# Altium schematic sheet Lan.SchDoc
size A3; SheetNumber: 8; SheetTotal: 8
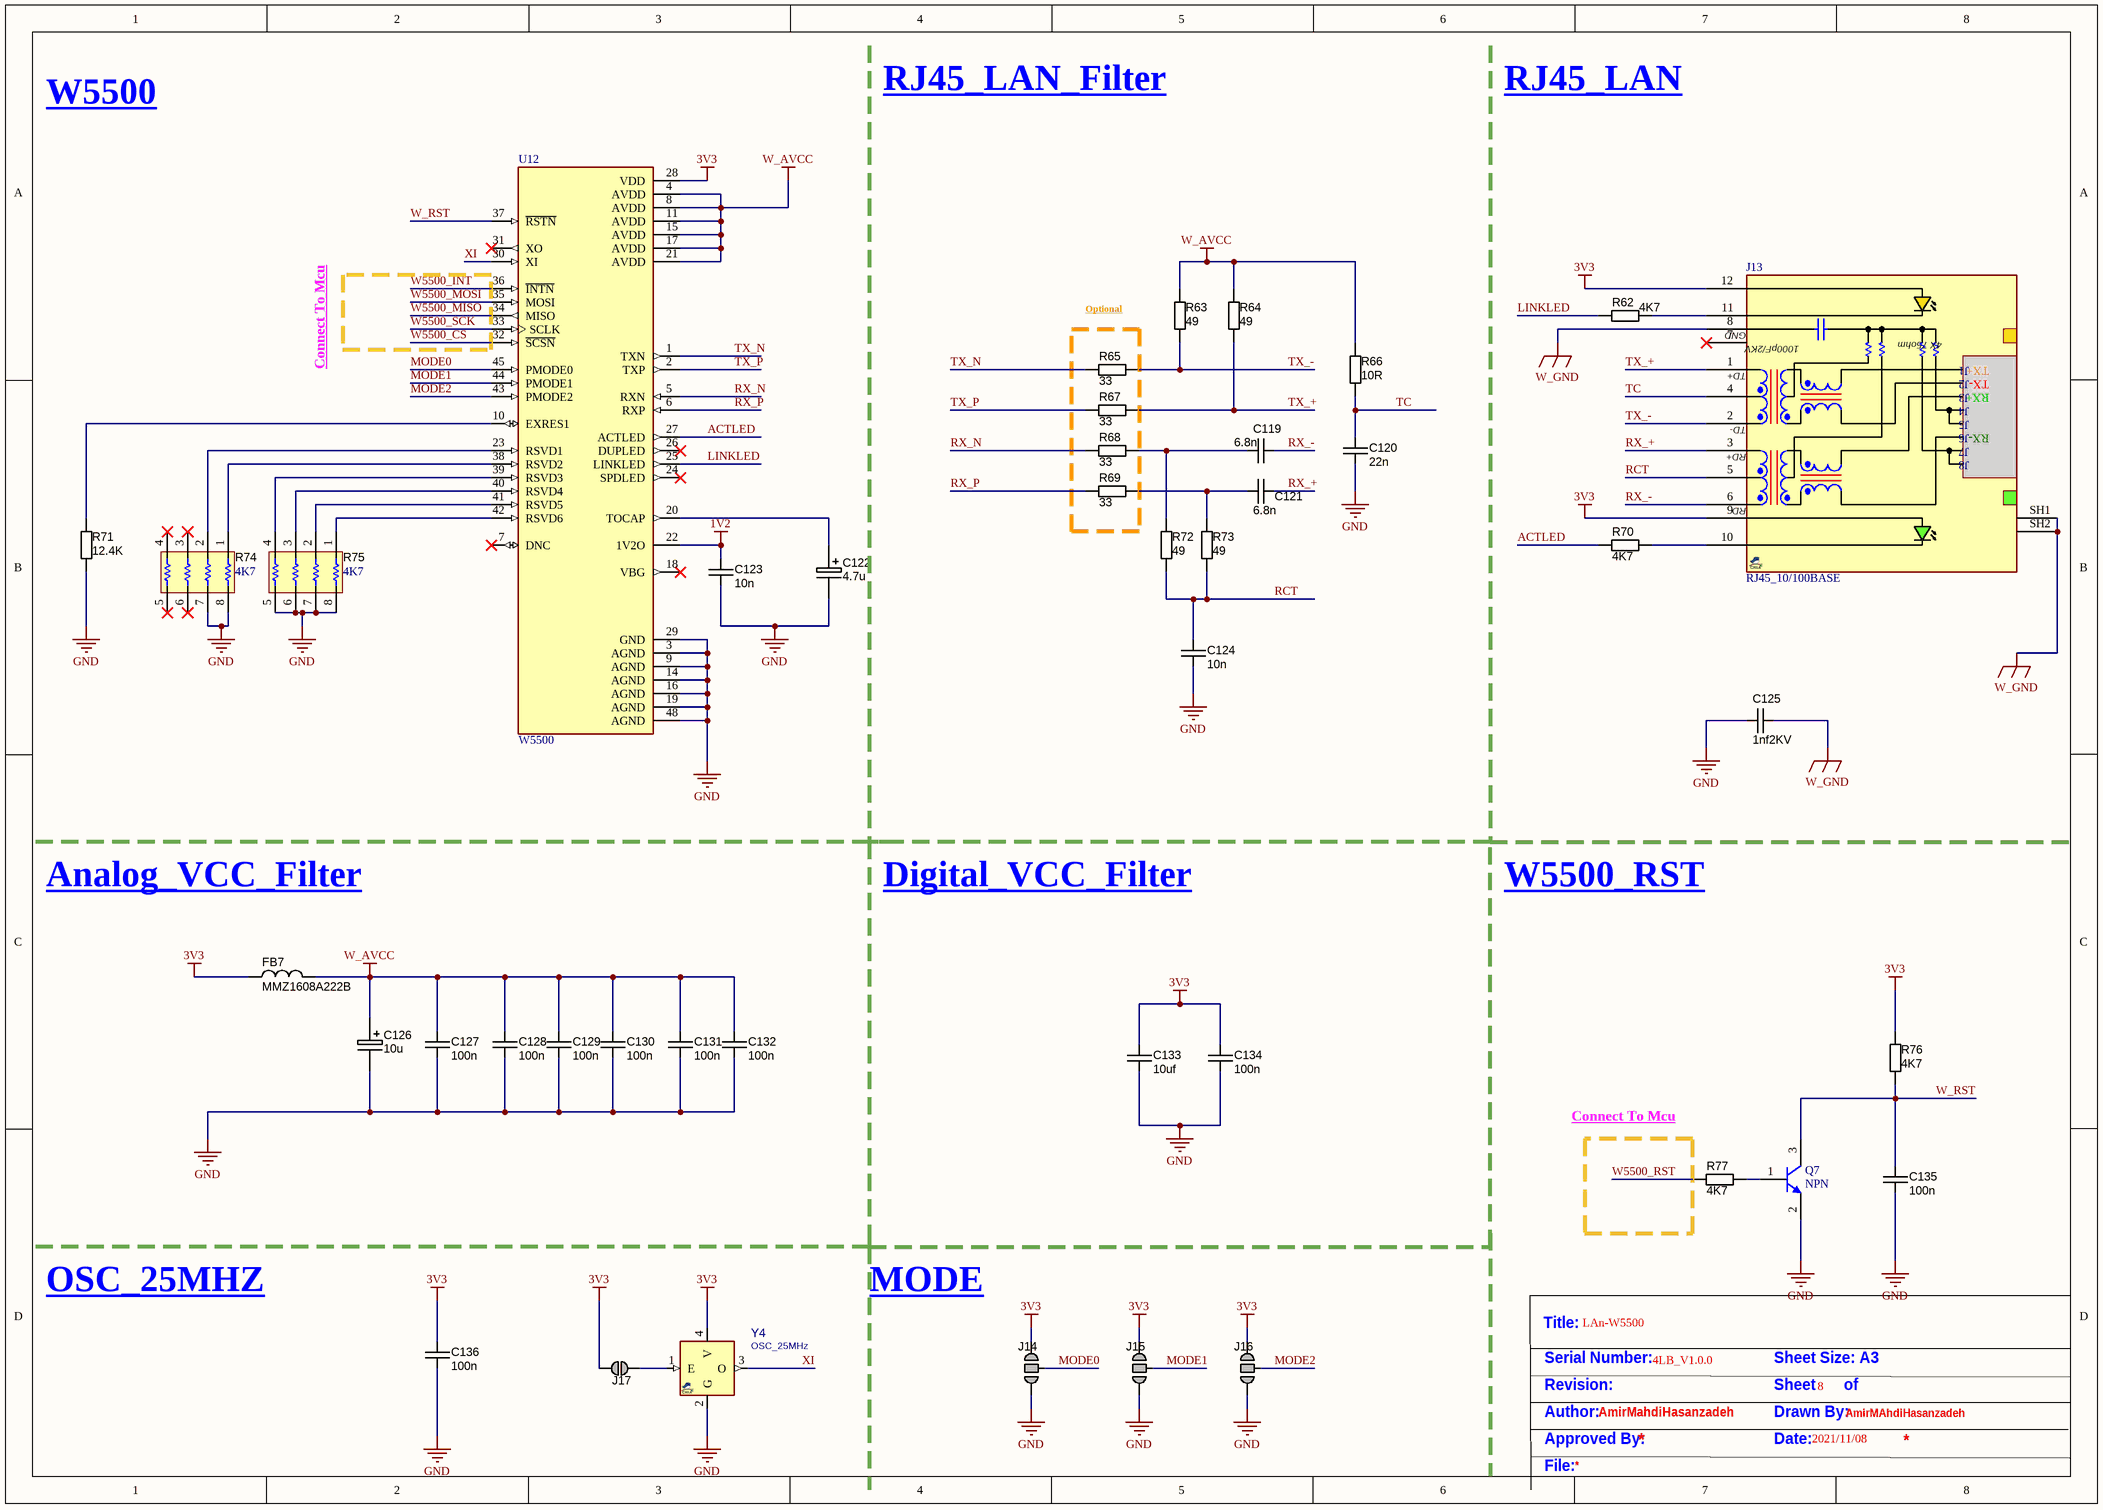
[diagram p0: Lan.SchDoc]

## Parts
C119  value 6.8n  [CAPC1608X90N]  (hidden comment: approved sub OK)
C120  value 22n  [CAPC1608X90N]  (hidden comment: approved sub OK)
C121  value 6.8n  [CAPC1608X90N]  (hidden comment: approved sub OK)
C122  value 4.7u  [C_TN_3216]
C123  value 10n  [CAPC1608X90N]  (hidden comment: approved sub OK)
C124  value 10n  [CAPC1608X90N]  (hidden comment: approved sub OK)
C125  value 1nf2KV  [C1206]  (hidden comment: approved sub OK)
C126  value 10u  [C_TN_3216]
C127  value 100n  [CAPC1608X90N]  (hidden comment: approved sub OK)
C128  value 100n  [CAPC1608X90N]  (hidden comment: approved sub OK)
C129  value 100n  [CAPC1608X90N]  (hidden comment: approved sub OK)
C130  value 100n  [CAPC1608X90N]  (hidden comment: approved sub OK)
C131  value 100n  [CAPC1608X90N]  (hidden comment: approved sub OK)
C132  value 100n  [CAPC1608X90N]  (hidden comment: approved sub OK)
C133  value 10uf  [CAPC1608X90N]  (hidden comment: approved sub OK)
C134  value 100n  [CAPC1608X90N]  (hidden comment: approved sub OK)
C135  value 100n  [CAPC1608X90N]  (hidden comment: approved sub OK)
C136  value 100n  [CAPC1608X90N]  (hidden comment: approved sub OK)
FB7  Manufacturer Part Number 1: MMZ1608A222B  [FBC1608X95N]  (hidden comment: 2K2 @ 100 MHz)
J13  RJ45_10/100BASE  [RJ45_8M_HR911105A]
J14  Jumper  [Jump_3Way]  (value not drawn)  (no BOM)
J15  Jumper  [Jump_3Way]  (value not drawn)  (no BOM)
J16  Jumper  [Jump_3Way]  (value not drawn)  (no BOM)
J17  Jumper  [JUMP1]  (value not drawn)  (no BOM)
Q7  NPN  [SOT23-3]
R62  value 4K7  [RESC1608X55N]  (hidden comment: Thick Film)
R63  value 49  [RESC1608X55N]  (hidden comment: Thick Film)
R64  value 49  [RESC1608X55N]  (hidden comment: Thick Film)
R65  value 33  [RESC1608X55N]  (hidden comment: Thick Film)
R66  value 10R  [RESC1608X55N]  (hidden comment: Thick Film)
R67  value 33  [RESC1608X55N]  (hidden comment: Thick Film)
R68  value 33  [RESC1608X55N]  (hidden comment: Thick Film)
R69  value 33  [RESC1608X55N]  (hidden comment: Thick Film)
R70  value 4K7  [RESC1608X55N]  (hidden comment: Thick Film)
R71  value 12.4K  [RESC1608X55N]  (hidden comment: Thick Film)
R72  value 49  [RESC1608X55N]  (hidden comment: Thick Film)
R73  value 49  [RESC1608X55N]  (hidden comment: Thick Film)
R74  value 4K7  [RP0603X4]  (hidden comment: Resistor Array SMD)
R75  value 4K7  [RP0603X4]  (hidden comment: Resistor Array SMD)
R76  value 4K7  [RESC1608X55N]  (hidden comment: Thick Film)
R77  value 4K7  [RESC1608X55N]  (hidden comment: Thick Film)
U12  W5500  [LQFP-48_N]
Y4  OSC_25MHz  [XTL_4_2520]

## Blocks framed on the sheet
Optional: R65 R67-R69

## Nets
1V2: C123.1 U12.22(1V2O)
3V3: C133.1 C134.1 C136.1 FB7.1 J13.9(GLED+) J13.12(YLED+) J14.3 J15.3 J16.3 J17.2 R76.1 U12.28(VDD) Y4.4(V)
GND: C120.2 C122.2 C123.2 C124.2 C125.1 C126.2 C127.2 C128.2 C129.2 C130.2 C131.2 C132.2 C133.2 C134.2 C135.2 C136.2 J14.1 J15.1 J16.1 Q7.2(E) R71.1 R74.7 R74.8 R75.5 R75.6 R75.7 R75.8 U12.3(AGND) U12.9(AGND) U12.14(AGND) U12.16(AGND) U12.19(AGND) U12.29(GND) U12.48(AGND) Y4.2(G)
W_AVCC: C126.1 C127.1 C128.1 C129.1 C130.1 C131.1 C132.1 FB7.2 R63.2 R64.2 R66.2 U12.4(AVDD) U12.8(AVDD) U12.11(AVDD) U12.15(AVDD) U12.17(AVDD) U12.21(AVDD)
W_GND: C125.2 J13.8(CHSGND) J13.SH1 J13.SH2
ACTLED: R70.1 U12.27(ACTLED)
LINKLED: R62.1 U12.25(LINKLED)
MODE0: J14.2 U12.45(PMODE0)
MODE1: J15.2 U12.44(PMODE1)
MODE2: J16.2 U12.43(PMODE2)
RCT: C124.1 J13.5(RCT) R72.1 R73.1
RX_+: C121.2 J13.3(RD+)
RX_-: C119.2 J13.6(RD-)
RX_N: R68.1 U12.5(RXN)
RX_P: R69.1 U12.6(RXP)
TC: C120.1 J13.4(TCT) R66.1
TX_+: J13.1(TD+) R64.1 R67.2
TX_-: J13.2(TD-) R63.1 R65.2
TX_N: R65.1 U12.1(TXN)
TX_P: R67.1 U12.2(TXP)
W5500_CS: U12.32(~{SCSN})
W5500_INT: U12.36(~{INTN})
W5500_MISO: U12.34(MISO)
W5500_MOSI: U12.35(MOSI)
W5500_RST: R77.1
W5500_SCK: U12.33(SCLK)
W_RST: C135.1 Q7.3(C) R76.2 U12.37(~{RSTN})
XI: U12.30(XI) Y4.3(O)
NetC119_1: C119.1 R68.2 R72.2
NetC121_1: C121.1 R69.2 R73.2
NetC122_1: C122.1 U12.20(TOCAP)
NetJ13_10: J13.10(GLED-) R70.2
NetJ13_11: J13.11(YLED-) R62.2
NetJ17_1: J17.1 Y4.1(E)
NetQ7_1: Q7.1(B) R77.2
NetR71_2: R71.2 U12.10(EXRES1)
NetR74_1: R74.1 U12.38(RSVD2)
NetR74_2: R74.2 U12.23(RSVD1)
NetR75_1: R75.1 U12.42(RSVD6)
NetR75_2: R75.2 U12.41(RSVD5)
NetR75_3: R75.3 U12.40(RSVD4)
NetR75_4: R75.4 U12.39(RSVD3)

Not connected (* = marked no-connect by the designer): J13 7(NC)*; R74 3* 4* 5* 6*; U12 7(DNC)* 18(VBG)* 24(SPDLED)* 26(DUPLED)* 31(XO)*

## Notes on the sheet
- W5500
- RJ45_LAN_Filter
- RJ45_LAN
- Connect To Mcu
- Analog_VCC_Filter
- Digital_VCC_Filter
- W5500_RST
- OSC_25MHZ
- MODE
- Title:
- LAn-W5500
- Serial Number:
- Revision:
- 4LB_V1.0.0
- Sheet       of
- Sheet Size: A3
- 8
- Author:
- Approved By:
- AmirMahdiHasanzadeh
- Date:
- Drawn By:
- 2021/11/08
- AmirMAhdiHasanzadeh
- File:
- (in symbol RJ45_HR911105A) GND; 4X 75ohm; 1000pF/2KV; J1; TX+; J2; TX-; J3; RX+; J4; J5; J6; RX-; J7; J8

## Library data of the parts
C119 = CAPC_100n_0603_X7R_50V_10%: Capacitor SMD Cer 6.8 10% 50V X7R 0603; Manufacturer 1: AVX Corporation; Manufacturer Part Number 1: 06035C104KAT2A; Ratings: 50V; X7R; Material: ceramic; SCDType: spec; Manufacturer 2: TDK Corporation; Manufacturer Part Number 2: C1608X7R1H104K; Package / Case: 0603 (1608 Metric); Tolerance: ±10%; Supplier 1: Digi-Key; Supplier Part Number 1: 478-5052-1-ND; ComponentLink1URL: http://www.avx.com/docs/Catalogs/cx7r.pdf; ComponentLink1Description: http://www.avx.com/docs/Catalogs/cx7r.pdf; Supplier 2: Digi-Key; Supplier Part Number 2: 445-1314-1-ND; ComponentLink2URL: http://product.tdk.com/capacitor/mlcc/en/documents/mlcc_commercial_general_en.pdf; ComponentLink2Description: http://product.tdk.com/capacitor/mlcc/en/documents/mlcc_commercial_general_en.pdf
C120 C124 C127-C136 = CAPC_100n_0603_X7R_50V_10%: Capacitor SMD Cer 100nF 10% 50V X7R 0603; Manufacturer 1: AVX Corporation; Manufacturer Part Number 1: 06035C104KAT2A; Ratings: 50V; X7R; Material: ceramic; SCDType: spec; Manufacturer 2: TDK Corporation; Manufacturer Part Number 2: C1608X7R1H104K; Package / Case: 0603 (1608 Metric); Tolerance: ±10%; Supplier 1: Digi-Key; Supplier Part Number 1: 478-5052-1-ND; ComponentLink1URL: http://www.avx.com/docs/Catalogs/cx7r.pdf; ComponentLink1Description: http://www.avx.com/docs/Catalogs/cx7r.pdf; Supplier 2: Digi-Key; Supplier Part Number 2: 445-1314-1-ND; ComponentLink2URL: http://product.tdk.com/capacitor/mlcc/en/documents/mlcc_commercial_general_en.pdf; ComponentLink2Description: http://product.tdk.com/capacitor/mlcc/en/documents/mlcc_commercial_general_en.pdf
C121 = CAPC_100n_0603_X7R_50V_10%: Capacitor SMD Cer 6.8nf 10% 50V X7R 0603; Manufacturer 1: AVX Corporation; Manufacturer Part Number 1: 06035C104KAT2A; Ratings: 50V; X7R; Material: ceramic; SCDType: spec; Manufacturer 2: TDK Corporation; Manufacturer Part Number 2: C1608X7R1H104K; Package / Case: 0603 (1608 Metric); Tolerance: ±10%; Supplier 1: Digi-Key; Supplier Part Number 1: 478-5052-1-ND; ComponentLink1URL: http://www.avx.com/docs/Catalogs/cx7r.pdf; ComponentLink1Description: http://www.avx.com/docs/Catalogs/cx7r.pdf; Supplier 2: Digi-Key; Supplier Part Number 2: 445-1314-1-ND; ComponentLink2URL: http://product.tdk.com/capacitor/mlcc/en/documents/mlcc_commercial_general_en.pdf; ComponentLink2Description: http://product.tdk.com/capacitor/mlcc/en/documents/mlcc_commercial_general_en.pdf
C122 = CAPT_4u7_3216_16V: Capacitor SMD Tantalum 4.7uF 10% 16V 3216-18; Manufacturer 1: Vishay/Sprague; Manufacturer Part Number 1: 293D475X9016A2TE3; SCDType: undef; Package / Case: EIA 535BAAC size A; Ratings: 16V; Tolerance: ±10%; Material: Tantalum; Supplier 1: Digi-Key; Supplier Part Number 1: 718-1148-1-ND
C123 = CAPC_100n_0603_X7R_50V_10%: Capacitor SMD Cer 10nF 10% 50V X7R 0603; Manufacturer 1: AVX Corporation; Manufacturer Part Number 1: 06035C104KAT2A; Ratings: 50V; X7R; Material: ceramic; SCDType: spec; Manufacturer 2: TDK Corporation; Manufacturer Part Number 2: C1608X7R1H104K; Package / Case: 0603 (1608 Metric); Tolerance: ±10%; Supplier 1: Digi-Key; Supplier Part Number 1: 478-5052-1-ND; ComponentLink1URL: http://www.avx.com/docs/Catalogs/cx7r.pdf; ComponentLink1Description: http://www.avx.com/docs/Catalogs/cx7r.pdf; Supplier 2: Digi-Key; Supplier Part Number 2: 445-1314-1-ND; ComponentLink2URL: http://product.tdk.com/capacitor/mlcc/en/documents/mlcc_commercial_general_en.pdf; ComponentLink2Description: http://product.tdk.com/capacitor/mlcc/en/documents/mlcc_commercial_general_en.pdf
C125 = CAPC_100n_0603_X7R_50V_10%: Capacitor SMD Cer 1nF 10% 2kv X7R 0603; Manufacturer 1: AVX Corporation; Manufacturer Part Number 1: 06035C104KAT2A; Ratings: 50V; X7R; Material: ceramic; SCDType: spec; Manufacturer 2: TDK Corporation; Manufacturer Part Number 2: C1608X7R1H104K; Package / Case: 0603 (1608 Metric); Tolerance: ±10%; Supplier 1: Digi-Key; Supplier Part Number 1: 478-5052-1-ND; ComponentLink1URL: http://www.avx.com/docs/Catalogs/cx7r.pdf; ComponentLink1Description: http://www.avx.com/docs/Catalogs/cx7r.pdf; Supplier 2: Digi-Key; Supplier Part Number 2: 445-1314-1-ND; ComponentLink2URL: http://product.tdk.com/capacitor/mlcc/en/documents/mlcc_commercial_general_en.pdf; ComponentLink2Description: http://product.tdk.com/capacitor/mlcc/en/documents/mlcc_commercial_general_en.pdf
C126 = CAPT_4u7_3216_16V: Capacitor SMD Tantalum 10uF 10% 16V 3216-18; Manufacturer 1: Vishay/Sprague; Manufacturer Part Number 1: 293D475X9016A2TE3; SCDType: undef; Package / Case: EIA 535BAAC size A; Ratings: 16V; Tolerance: ±10%; Material: Tantalum; Supplier 1: Digi-Key; Supplier Part Number 1: 718-1148-1-ND
FB7 = FERRITE_2K2-100MHz_0603: Ferrite bead 2.2K Ohm at 100 MHz 200mA 0603 SMD; Manufacturer 1: TDK Corporation; Ratings: 200 mA; 800 mOhm DC; Impedance @ Frequency: 2200 Ohm @ 100MHz; DC Resistance (DCR): 800 mOhm Max; Filter Type: Differential Mode - Single; SCDType: source; Size / Dimension: 0.063" L x 0.031" W (1.60mm x 0.80mm); Current Rating: 200mA; Package / Case: 0603 (1608 Metric); Height (Max): 0.037" (0.95mm); Mounting Type: Surface Mount; Supplier 1: Digi-Key; Supplier Part Number 1: 445-8671-1-ND; RoHS 1: RoHS Compliant; ComponentLink1URL: http://www.tdk.co.jp/tefe02/e9412_mmz.pdf; ComponentLink1Description: http://www.tdk.co.jp/tefe02/e9412_mmz.pdf; Value: 2K2 @ 100 MHz
J13 = RJ45_HR911105A: RJ45, 10/100BASE, G/Y LED; MANF: Hanrun; MANF_P#: HR911105A; PARAM2: 10/100BASE, G/Y LED; VALUE: RJ45_10/100BASE
J14-J16 = JUMP_3WAY: SMD jumper
J17 = JUMP1: SMD jumper
Q7 = NPN: NPN Bipolar Transistor; Published: 8-Jun-2000; LatestRevisionDate: 17-Jul-2002; LatestRevisionNote: Re-released for DXP Platform.; PackageReference: TO-226-AA; Publisher: Altium Limited; PackageDescription: TO, Flat Index; 3 In-Line, Axial Leads; Body Dia. 4.8mm; Leads 0.55 x 0.51 mm (max); Code_JEDEC: TO-226-AA
R62 R70 R76 R77 = RES_4K7_0603_5%: Resistor SMD chip 4.7k Ohm 0.1W 5% 0603; Manufacturer 1: Vishay/Dale; Manufacturer Part Number 1: CRCW06034K70JNEA; Ratings: 1/10 W; SCDType: spec; Package / Case: 0603 (1608 metric); Tolerance: ±5%; Material: Thick Film; Supplier 1: Digi-Key; Supplier Part Number 1: 541-4.7KGCT-ND
R63 R64 R72 R73 = RES_4K7_0603_5%: Resistor SMD chip 49 Ohm 0.1W 5% 0603; Manufacturer 1: Vishay/Dale; Manufacturer Part Number 1: CRCW06034K70JNEA; Ratings: 1/10 W; SCDType: spec; Package / Case: 0603 (1608 metric); Tolerance: ±5%; Material: Thick Film; Supplier 1: Digi-Key; Supplier Part Number 1: 541-4.7KGCT-ND
R65 R67-R69 = RES_4K7_0603_5%: Resistor SMD chip 33 Ohm 0.1W 5% 0603; Manufacturer 1: Vishay/Dale; Manufacturer Part Number 1: CRCW06034K70JNEA; Ratings: 1/10 W; SCDType: spec; Package / Case: 0603 (1608 metric); Tolerance: ±5%; Material: Thick Film; Supplier 1: Digi-Key; Supplier Part Number 1: 541-4.7KGCT-ND
R66 = RES_4K7_0603_5%: Resistor SMD chip 10 Ohm 0.1W 5% 0603; Manufacturer 1: Vishay/Dale; Manufacturer Part Number 1: CRCW06034K70JNEA; Ratings: 1/10 W; SCDType: spec; Package / Case: 0603 (1608 metric); Tolerance: ±5%; Material: Thick Film; Supplier 1: Digi-Key; Supplier Part Number 1: 541-4.7KGCT-ND
R71 = RES_4K7_0603_5%: Resistor SMD chip 12.4K Ohm 0.1W 1% 0603; Manufacturer 1: Vishay/Dale; Manufacturer Part Number 1: CRCW06034K70JNEA; Ratings: 1/10 W; Tolerance: ±5%; SCDType: spec; Package / Case: 0603 (1608 metric); Material: Thick Film; Supplier 1: Digi-Key; Supplier Part Number 1: 541-4.7KGCT-ND
U12 = W5500: Socket Contact Silver 17-20 AWG Crimp Power; MF: WIZnet; Price: None; Package: LQFP-48 WIZnet; Value: *; MP: W5500; Availability: Unavailable; SnapEDA_Link: https://www.snapeda.com/parts/W5500/WIZnet/view-part/45250/?ref=snap
Y4 = OSC_4_25MHz_3225E: CLOCK OSCILLATOR, 25MHz, 10PPM, 3.2X2.5mm; MANF: ECS; PARAM: 10PPM, 15pF, -40~85oC; DESC: DESCRIPTION; DIST#: MOUSER; PARAM2: 1.8~3.3V; MANF_P#: ECS-3225S18-250-FN-TR; ASSEMBLY: ASSEMBLY; PRICE: 1= 1.2$; Value: OSC_25MHz
R74 R75 = Resistor Array SMD: DatasheetVersion: 2021; ComponentLink1Description: Website Smart World; ComponentLink1URL: https://www.smartw.ir/; ComponentLink2Description: Telegram; ComponentLink2URL: https://t.me/altium_smartw; ComponentLink3Description: Instagram; ComponentLink3URL: https://Instagram.com/smartgw.ir